# EAGLE design CMSIS-DAP.V1 (EAGLE 6.4)
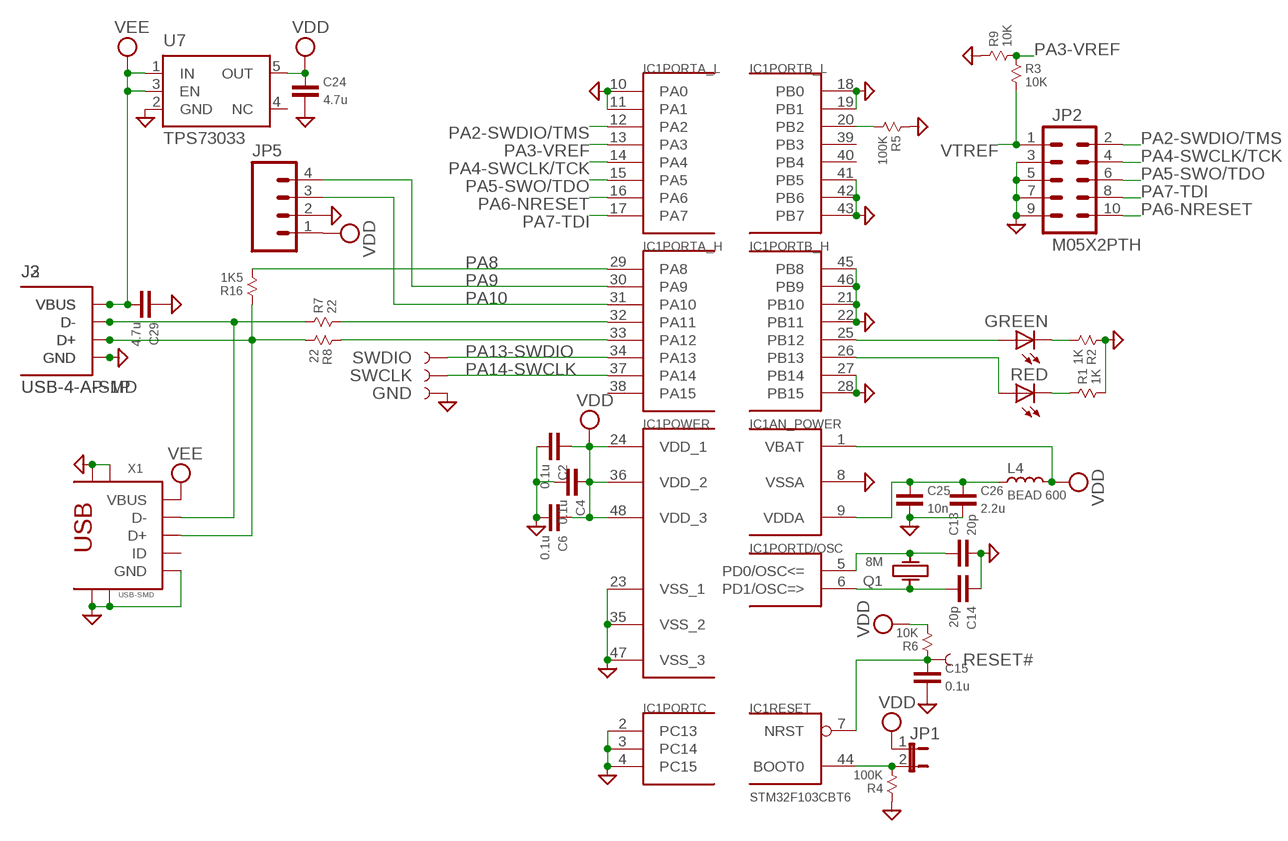
[diagram p0: schematic, sheet 1]

## Parts
C2  0.1u  CAP-0603  [0603]
C4  0.1u  CAP-0603  [0603]
C6  0.1u  CAP-0603  [0603]
C13  20p  CAP-0603  [0603]
C14  20p  CAP-0603  [0603]
C15  0.1u  CAP-0603  [0603]
C24  4.7u  CAP-0603  [0603]
C25  10n  CAP-0603  [0603]
C26  2.2u  CAP-0603  [0603]
C29  4.7u  CAP-0603  [0603]
GND  TEST-POINT1  [PAD.1X1]
GREEN  LEDCHIPLED_0603  [CHIPLED_0603]
IC1  STM32F103CBT6  STM32F10XCXT6  [TQFP48]
J2  USB-4-AP-1P  [USBAP-1P]
J3  USB-4-A-SMD  [USB-A-SMD]
JP1  JUMPER-2SMD-NO  [SJ_2S-NO]
JP2  M05X2PTH  [AVR_ICSP]
JP5  M04PTH  [1X04]
L4  BEAD 600  INDUCTOR-0603  [0603]
Q1  8M  CRYSTAL-KX-9A  [KX-9A]
R1  1K  RESISTOR-0603  [0603]
R2  1K  RESISTOR-0603  [0603]
R3  10K  RESISTOR-0603  [0603]
R4  100K  RESISTOR-0603  [0603]
R5  100K  RESISTOR-0603  [0603]
R6  10K  RESISTOR-0603  [0603]
R7  22  RESISTOR-0603  [0603]
R8  22  RESISTOR-0603  [0603]
R9  10K  RESISTOR-0603  [0603]
R16  1K5  RESISTOR-0603  [0603]
RED  LEDCHIPLED_0603  [CHIPLED_0603]
RESET#  TEST-POINT3  [PAD.03X.03]
SWCLK  TEST-POINT1  [PAD.1X1]
SWDIO  TEST-POINT1  [PAD.1X1]
U7  TPS73033  [SOT23-5]
X1  USB-SMD  [USB-MINIB]

## Nets
BOOT0: IC1.44(RESET:BOOT0) JP1.2 R4.2
GND: C2.1 C4.1 C6.1 C13.1 C14.2 C15.1 C24.1 C25.1 C26.1 C29.2 GND.P$1 IC1.2(PORTC:PC13) IC1.3(PORTC:PC14) IC1.4(PORTC:PC15) IC1.8(AN_POWER:VSSA) IC1.10(PORTA_L:PA0) IC1.11(PORTA_L:PA1) IC1.18(PORTB_L:PB0) IC1.19(PORTB_L:PB1) IC1.21(PORTB_H:PB10) IC1.22(PORTB_H:PB11) IC1.23(POWER:VSS_1) IC1.27(PORTB_H:PB14) IC1.28(PORTB_H:PB15) IC1.35(POWER:VSS_2) IC1.41(PORTB_L:PB5) IC1.42(PORTB_L:PB6) IC1.43(PORTB_L:PB7) IC1.45(PORTB_H:PB8) IC1.46(PORTB_H:PB9) IC1.47(POWER:VSS_3) J2.GND J3.GND JP2.3 JP2.5 JP2.7 JP2.9 JP5.2 R1.2 R2.1 R4.1 R5.1 R9.1 U7.2(GND) X1.GND X1.GND@1(GND) X1.GND@2(GND) X1.GND@3(GND) X1.GND@4(GND)
N$2: R1.1 RED.C
N$3: C25.2 C26.2 IC1.9(AN_POWER:VDDA) L4.1
N$10: J2.D- J3.D- R7.1 X1.D-
N$12: GREEN.C R2.2
N$13: J2.D+ J3.D+ R8.2 R16.1 X1.D+
OSCIN: C14.1 IC1.6(PORTD/OSC:PD1/OSC=>) Q1.1
OSCOUT: C13.2 IC1.5(PORTD/OSC:PD0/OSC<=) Q1.3
PA2-SWDIO/TMS: IC1.12(PORTA_L:PA2) JP2.2
PA3-VREF: IC1.13(PORTA_L:PA3) R3.1 R9.2
PA4-SWCLK/TCK: IC1.14(PORTA_L:PA4) JP2.4
PA5-SWO/TDO: IC1.15(PORTA_L:PA5) JP2.6
PA6-NRESET: IC1.16(PORTA_L:PA6) JP2.10
PA7-TDI: IC1.17(PORTA_L:PA7) JP2.8
PA8: IC1.29(PORTA_H:PA8) R16.2
PA9: IC1.30(PORTA_H:PA9) JP5.4
PA10: IC1.31(PORTA_H:PA10) JP5.3
PA11: IC1.32(PORTA_H:PA11) R7.2
PA12: IC1.33(PORTA_H:PA12) R8.1
PA13-SWDIO: IC1.34(PORTA_H:PA13) SWDIO.P$1
PA14-SWCLK: IC1.37(PORTA_H:PA14) SWCLK.P$1
PB2/BOOT1: IC1.20(PORTB_L:PB2) R5.2
PB12: GREEN.A IC1.25(PORTB_H:PB12)
PB13: IC1.26(PORTB_H:PB13) RED.A
RESET#: C15.2 IC1.7(RESET:NRST) R6.1 RESET#.P$1
VDD: C2.2 C4.2 C6.2 C24.2 IC1.1(AN_POWER:VBAT) IC1.24(POWER:VDD_1) IC1.36(POWER:VDD_2) IC1.48(POWER:VDD_3) JP1.1 JP5.1 L4.2 R6.2 U7.5(OUT)
VEE: C29.1 J2.VBUS J3.VUSB(VBUS) U7.1(IN) U7.3(EN) X1.VBUS
VTREF: JP2.1 R3.2
Unconnected: IC1.38(PORTA_H:PA15) IC1.39(PORTB_L:PB3) IC1.40(PORTB_L:PB4) U7.4(NC) X1.ID

## Library data of the parts
C2 C4 C6 C13-C15 C24-C26 C29 = X893:CAP: Capacitor
GND RESET# SWCLK SWDIO = SparkFun:TEST-POINT
GREEN RED = led:LED: LED OSRAM: - CHIPLED LG R971, LG N971, LY N971, LG Q971, LY Q971, LO R971, LY R971 LH N974, LH R974 LS Q976, LO Q976, LY Q976 LO Q996 - Hyper CHIPLED LW Q18S LB Q993, LB Q99A, LB R99A - SideLED LS A670, LO A670, LY A670, LG A670, LP A670 LB A673, LV A673, LT A673, LW A673 LH A674 LY A675 LS A676, LA A676, LO A676, LY A676, LW A676 LS A679, LY A679, LG A679 - Hyper Micro SIDELED® LS Y876, LA Y876, LO Y876, LY Y876 LT Y87S - SmartLED LW L88C, LW L88S LB L89C, LB L89S, LG L890 LS L89K, LO L89K, LY L89K LS L896, LA L896, LO L896, LY L896 - TOPLED LS T670, LO T670, LY T670, LG T670, LP T670 LSG T670, LSP T670, LSY T670, LOP T670, LYG T670 LG T671, LOG T671, LSG T671 LB T673, LV T673, LT T673, LW T673 LH T674 LS T676, LA T676, LO T676, LY T676, LB T676, LH T676, LSB T676, LW T676 LB T67C, LV T67C, LT T67C, LS T67K, LO T67K, LY T67K, LW E67C LS E67B, LA E67B, LO E67B, LY E67B, LB E67C, LV E67C, LT E67C LW T67C LS T679, LY T679, LG T679 LS T770, LO T770, LY T770, LG T770, LP T770 LB T773, LV T773, LT T773, LW T773 LH T774 LS E675, LA E675, LY E675, LS T675 LS T776, LA T776, LO T776, LY T776, LB T776 LHGB T686 LT T68C, LB T68C - Hyper Mini TOPLED® LB M676 - Mini TOPLED Santana® LG M470 LS M47K, LO M47K, LY M47K Source: http://www.osram.convergy.de LUXEON: - LUMILED® LXK2-PW12-R00, LXK2-PW12-S00, LXK2-PW14-U00, LXK2-PW14-V00 LXK2-PM12-R00, LXK2-PM12-S00, LXK2-PM14-U00 LXK2-PE12-Q00, LXK2-PE12-R00, LXK2-PE12-S00, LXK2-PE14-T00, LXK2-PE14-U00 LXK2-PB12-K00, LXK2-PB12-L00, LXK2-PB12-M00, LXK2-PB14-N00, LXK2-PB14-P00, LXK2-PB14-Q00 LXK2-PR12-L00, LXK2-PR12-M00, LXK2-PR14-Q00, LXK2-PR14-R00 LXK2-PD12-Q00, LXK2-PD12-R00, LXK2-PD12-S00 LXK2-PH12-R00, LXK2-PH12-S00 LXK2-PL12-P00, LXK2-PL12-Q00, LXK2-PL12-R00 Source: www.luxeon.com KINGBRIGHT: KA-3528ASYC Source: www.kingbright.com
IC1 = stm32:STM32F10XCXT6: ST STM32F101/103 48pin LQFP
J2 J3 = X893:USB-4: http://www.hirose.co.jp/cataloge_hp/e24200011.pdf
JP1 = SparkFun:JUMPER-2: Jumper Basic 0.1" spaced jumper. Use with breakaway headers.
JP2 = SparkFun:M05X2: Header 5x2 Standard 10-pin dual row 0.1" header. Commonly used with AVR-ISP. Use with Spark Fun Electronics SKU: PRT-00778
JP5 = SparkFun:M04: Header 4 Standard 4-pin 0.1" header. Use with straight break away headers (SKU : PRT-00116), right angle break away headers (PRT-00553), swiss pins (PRT-00743), machine pins (PRT-00117), and female headers (PRT-00115). Molex polarized connector foot print use with SKU : PRT-08231 with associated crimp pins and housings.
L4 = X893:INDUCTOR: http://www.murata.com/products/catalog/pdf/o05e.pdf
Q1 = X893:CRYSTAL: Crystal
R1-R9 R16 = X893:RESISTOR
U7 = X893:TPS73033: LOW-NOISE, HIGH PSRR, RF 200-mA LOW-DROPOUT LINEAR REGULATOR http://www.terraelectronica.ru/pdf/TI/TPS73033.pdf
X1 = X893:USB: USB Connectors USB-B-PTH is fully proven SKU : PRT-00139 USB-miniB is fully proven SKU : PRT-00587 USB-A-PCB is untested. USB-A-H is throughly reviewed, but untested. Spark Fun Electronics SKU : PRT-00437 USB-B-SMT is throughly reviewed, but untested. Needs silkscreen touching up. USB-A-S has not been used/tested USB-MB-H has not been used/tested

## Board
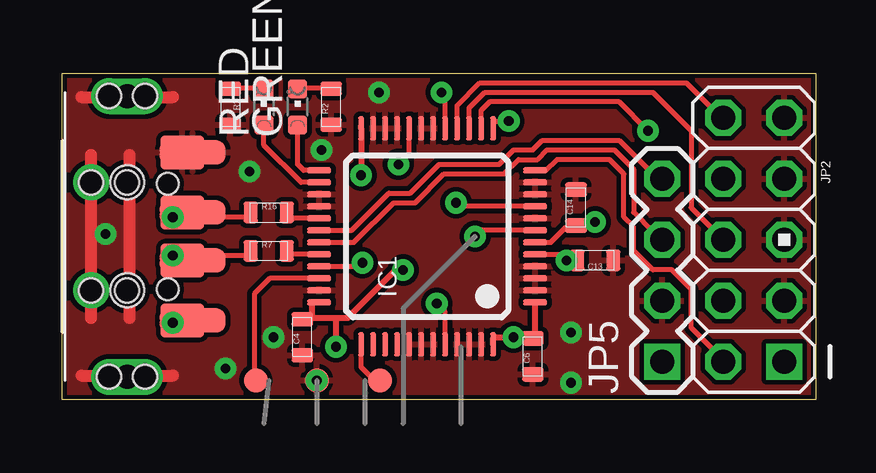
[diagram p1: board, top side]
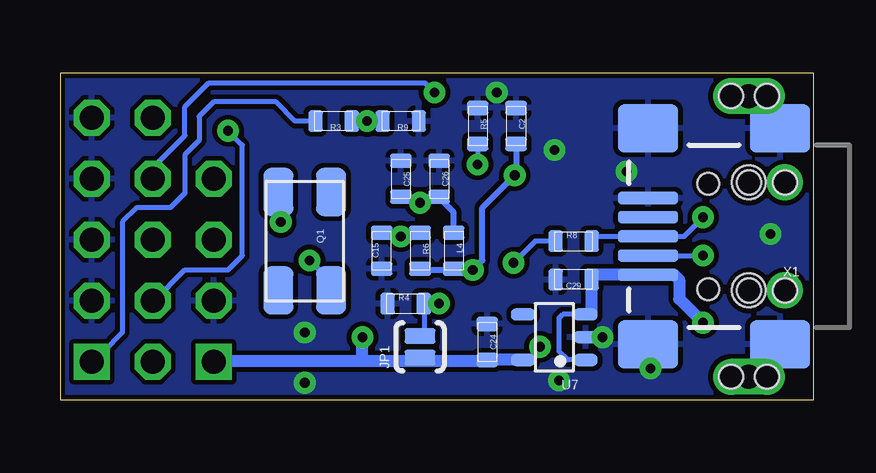
[diagram p2: board, bottom side, seen from below]

Size 31.4 x 13.6 mm. Coordinates in mm from the lower left corner, seen from the top.
Outline: 0,0 0,13.6 31.4,13.6 31.4,0 0,0
Copper layers (1*16): Top 0.035mm / dielectric 1.5mm / Bottom 0.035mm
Design rules "default": minimum track width 0.2mm, minimum drill 0.4mm, track to track 0.2mm, track to pad 0.2mm, pad to pad 0.2mm, via to via 0.2mm, smd to smd 0mil, copper to edge 0.2mm, drill to drill 0.2mm, minimum pad ring 0.25mm, minimum via ring 0.25mm, stop-mask expansion 4mil, vias tented up to drill 0.4mm, thermal gap 0.2mm

### Footprints (pad centres in the part's own frame; a part is rotated, then mirrored left to right if it is on the bottom)
0603 = smd 0.6 x 0.9: 1 -0.75,0; 2 0.75,0
PAD.1X1 = smd 1 x 1: P$1 0,0
CHIPLED_0603 = smd 0.8 x 0.8: A 0,-0.75; C 0,0.75
TQFP48 = smd 0.25 x 1: 1 -2.75,-4.5; 2 -2.25,-4.5; 3 -1.75,-4.5; 4 -1.25,-4.5; 5 -0.75,-4.5; 6 -0.25,-4.5; 7 0.25,-4.5; 8 0.75,-4.5; 9 1.25,-4.5; 10 1.75,-4.5; 11 2.25,-4.5; 12 2.75,-4.5; 25 2.75,4.5; 26 2.25,4.5; 27 1.75,4.5; 28 1.25,4.5; 29 0.75,4.5; 30 0.25,4.5; 31 -0.25,4.5; 32 -0.75,4.5; 33 -1.25,4.5; 34 -1.75,4.5; 35 -2.25,4.5; 36 -2.75,4.5 | smd 1 x 0.25: 13 4.5,-2.75; 14 4.5,-2.25; 15 4.5,-1.75; 16 4.5,-1.25; 17 4.5,-0.75; 18 4.5,-0.25; 19 4.5,0.25; 20 4.5,0.75; 21 4.5,1.25; 22 4.5,1.75; 23 4.5,2.25; 24 4.5,2.75; 37 -4.5,2.75; 38 -4.5,2.25; 39 -4.5,1.75; 40 -4.5,1.25; 41 -4.5,0.75; 42 -4.5,0.25; 43 -4.5,-0.25; 44 -4.5,-0.75; 45 -4.5,-1.25; 46 -4.5,-1.75; 47 -4.5,-2.25; 48 -4.5,-2.75
USBAP-1P = smd 1.4 x 1.8: D+ 1,-5; D- -1,-5; GND 3.5,-5; VBUS -3.5,-5 | drill 1: P$1 -2.25,-1.2; P$2 -2.25,-2.7; P$3 2.25,-1.2; P$4 2.25,-2.7 | hole 1: -2.25,-1.2; 2.25,-1.2; 2.25,-2.7; -2.25,-2.7
USB-A-SMD = smd 2.75 x 1: D+ 5.325,1; D- 5.325,-1; GND 5.325,3.5; VUSB 5.325,-3.5 | drill 1 pad 1.4 long: GND@1 2.6,5.85; GND@2 2.6,-5.85 | hole 1: 3.35,-5.85; 1.85,-5.85; 3.35,5.85; 1.85,5.85 | hole 1.4: 2.6,2.25; 2.6,-2.25
SJ_2S-NO = smd 0.635 x 1.27: 1 -0.45,0; 2 0.45,0
AVR_ICSP = drill 1 pad 1.5 square: 1 -1.27,5.08 | drill 1 pad 1.5 octagon: 2 1.27,5.08; 3 -1.27,2.54; 4 1.27,2.54; 5 -1.27,0; 6 1.27,0; 7 -1.27,-2.54; 8 1.27,-2.54; 9 -1.27,-5.08; 10 1.27,-5.08
1X04 = drill 1 pad 1.5 square: 1 0,0 | drill 1 pad 1.5 octagon: 2 2.54,0; 3 5.08,0; 4 7.62,0
KX-9A = smd 2 x 1.25: 1 -2.05,-1.1; 2 2.05,-1.1; 3 2.05,1.1; 4 -2.05,1.1
PAD.03X.03 = smd 0.762 x 0.762: P$1 0,0
SOT23-5 = smd 0.5 x 1: 1 -0.95,-1.3; 2 0,-1.3; 3 0.95,-1.3; 4 0.95,1.3; 5 -0.95,1.3
USB-MINIB = smd 2.5 x 0.5: D+ 2.5,0; D- 2.5,0.8; GND 2.5,-1.6; ID 2.5,-0.8; VBUS 2.5,1.6 | smd 2.5 x 2: GND@1 -3,-4.5; GND@2 -3,4.5; GND@3 2.5,4.5; GND@4 2.5,-4.5 | hole 0.9: 0,2.2; 0,-2.2

### Placement (x,y rotation side)
C2  12.4,11.4 270 bottom
C4  10,2.6 90 top
C6  19.6,1.8 90 top
C13  22.2,5.8 180 top
C14  21.4,8 90 top
C15  18,6.2 90 bottom
C24  13.6,2.4 270 bottom
C25  17.2,9.2 270 bottom
C26  15.6,9.2 270 bottom
C29  10,5 180 bottom
GND  10.6,0.8 0 top
GREEN  9.8,12.2 0 top
IC1  15.2,6.8 90 top
J2  0,6.8 90 top
J3  0.1,6.8 0 top
JP1  16.4,2.2 90 bottom
JP2  28.81,6.66 180 top
JP5  25,1.58 90 top
L4  15,6.2 270 bottom
Q1  21.2,6.6 270 bottom
R1  7,12.2 270 top
R2  11.2,12.2 90 top
R3  20,11.6 180 bottom
R4  17,4 0 bottom
R5  14,11.4 270 bottom
R6  16.4,6.2 270 bottom
R7  8.6,6.2 0 top
R8  10,6.6 0 bottom
R9  17.2,11.6 180 bottom
R16  8.6,7.8 0 top
RED  8.4,12.2 0 top
RESET#  17.2,6.8 270 bottom
SWCLK  13.24,0.8 0 top
SWDIO  8.06,0.8 0 top
U7  10.8,2.6 90 bottom
X1  4.4,6.8 180 bottom

### Tracks (layer width: path | path; a pad name or v marks a point on that pad's centre or on a via)
BOOT0  (via drill 0.4)
  Top 0.2: 15.8,3.8 v15.6,4 15.95,3.65 IC1.44
  Bottom 0.2: R4.2 16.2,4 | 16.2,4 v15.6,4 | JP1.2 16.2,2.65 16.2,4
GND  (via drill 0.4)
  Top 0.4: J2.GND J3.GND
  Top 0.5: 0.8,12.6 4.6,12.6 | 0.8,1 4.6,1 | 2.8,3.4 2.8,10.2 | 1.2,3.4 1.2,10.2
  other vias: 8.8,2.6 10.6,0.8 10.8,10.4 21.2,2.8 13.2,12.8 21.2,0.7 6.8,1.3 7.8,9.5 1.8,6.9
  pour Top: 0,13.6 0,0 31.4,0 31.4,13.6
  pour Bottom: 0,13.6 0,0 31.4,0 31.4,13.6
N$2
  Top 0.2: R1.1 7,13 8.4,13 RED.C
N$3  (via drill 0.4)
  Top 0.2: IC1.9 16.65,8.05 v16.4,8.2
  Bottom 0.2: C25.2 16.35,8.45 | 16.45,8.45 v16.4,8.2 16.35,8.45 | C26.2 16.35,8.45
  Bottom 0.25: L4.1 15,7.8 15.6,8.4 15.75,8.4 C26.2
N$10  (via drill 0.4)
  Top 0.2: J2.D- 4.8,5.8 v4.6,6 7.8,6 7.8,6.2 R7.1
  Top 0.4: J2.D- J3.D-
  Bottom 0.2: X1.D- v4.6,6
N$12
  Top 0.2: GREEN.C 9.8,13 11.15,13 R2.2
N$13  (via drill 0.4)
  Top 0.2: J2.D+ 4.8,7.8 v4.6,7.6 7.8,7.6 7.8,7.8 R16.1
  Top 0.4: J2.D+ J3.D+
  Bottom 0.2: v4.6,7.6 5.4,6.8 X1.D+ 9.2,6.8 9.2,6.6 R8.2
OSCIN  (via drill 0.4)
  Top 0.2: IC1.6 20.35,6.55 21,7.2 21.4,7.2 C14.1 21.4,7.4 v22.2,7.4
  Bottom 0.2: Q1.1 22.3,7.5 v22.2,7.4
OSCOUT  (via drill 0.4)
  Top 0.2: C13.2 v21,5.8 20.75,6.05 IC1.5
  Bottom 0.2: Q1.3 20.3,4.5 20.6,4.8 20.6,5.4 v21,5.8
PA2-SWDIO/TMS
  Top 0.2: JP2.2 27.4,1.72 27.4,1.8 26.2,3 26.2,4.6 25.4,5.4 24.6,5.4 23.8,6.2 23.8,7.2 23.4,7.6 23.4,9.4 22.8,10 20.6,10 20.15,9.55 IC1.12
PA3-VREF  (via drill 0.4)
  Top 0.2: IC1.13 R9.2 v18.6,11.6
  Bottom 0.2: R3.1 v18.6,11.6 R9.2
PA4-SWCLK/TCK  (via drill 0.4)
  Top 0.2: v24.4,11.2 23.2,12.4 17.8,12.4 17.45,12.05 IC1.14
  Bottom 0.2: JP2.4 27.48,4.12 26.2,5.4 24.4,5.4 23.8,6 23.8,10.6 v24.4,11.2
PA5-SWO/TDO
  Top 0.2: IC1.15 16.95,12.15 17.6,12.8 24.6,12.8 26.2,11.2 26.2,8 27.4,6.8 27.4,6.72 JP2.6
PA6-NRESET
  Top 0.2: IC1.16 16.45,12.25 17.4,13.2 26,13.2 27.2,12 27.28,12 JP2.10
PA7-TDI  (via drill 0.4)
  Top 0.2: IC1.17 15.95,12.65 v15.8,12.8
  Bottom 0.2: JP2.8 27.4,9.2 27.4,9.8 26.2,11 26.2,12.2 25.2,13.2 16.2,13.2 v15.8,12.8
PA8
  Top 0.2: IC1.29 9.45,7.55 9.4,7.6 R16.2
PA9
  Top 0.2: IC1.30 12.05,7.05 13.6,8.6 14.5,8.6 15.7,9.8 18.2,9.8 18.8,10.4 19.6,10.4 20,10.8 23.2,10.8 24.6,9.4 24.8,9.4 JP5.4
PA10
  Top 0.2: IC1.31 12.15,6.55 13.8,8.2 14.7,8.2 15.9,9.4 18.4,9.4 19,10 19.8,10 20.2,10.4 23,10.4 23.8,9.6 23.8,7.8 24.6,7 24.66,7 JP5.3
PA11
  Top 0.2: IC1.32 9.4,6.05 R7.2
PA12  (via drill 0.4)
  Top 0.2: v12.5,5.7 12.35,5.55 IC1.33
  Bottom 0.2: R8.1 11.6,6.6 v12.5,5.7
PA13-SWDIO
  Top 0.2: IC1.34 8.65,5.05 8,4.4 8,0.8 SWDIO.P$1
PA14-SWCLK
  Top 0.2: IC1.37 12.45,1.35 13,0.8 SWCLK.P$1
PB2/BOOT1  (via drill 0.4)
  Top 0.2: v14,9.8 14.45,10.25 IC1.20
  Bottom 0.2: R5.2 v14,9.8
PB12
  Top 0.2: IC1.25 10.05,9.55 9.8,9.8 GREEN.A
PB13
  Top 0.2: IC1.26 9.95,9.05 8.4,10.6 RED.A
RESET#  (via drill 0.4)
  Top 0.2: IC1.7 17.45,7.05 RESET#.P$1
  Bottom 0.2: R6.1 16.65,6.8 RESET#.P$1 17.45,6.95 C15.2
  other vias: 17.2,6.8
VDD  (via drill 0.4)
  Top 0.2: 19.55,2.6 C6.2
  Top 0.25: IC1.1 19.7,2.67 C6.2 | IC1.36 10.4,4.05 10.4,3.4 | 10.4,3.4 10,3.4 C4.2 | IC1.48 17.95,2.55 18,2.6 v18.8,2.6 19.55,2.6 | 10.4,3.4 11.4,3.4 | 11.4,3.4 v11.4,2.2 | 11.4,3.4 11.9,3.4 13.9,5.4 v14.2,5.4 | 12.45,11.4 IC1.24 v12.45,9.35
  Bottom 0.25: U7.5 11.75,1.65 11.4,2 v11.4,2.2 | R6.2 16.4,5.4 15,5.4 | 15,5.4 v14.2,5.4 13.8,5.8 13.8,8 v12.45,9.35 12.4,9.6 C2.2 | L4.2 15,5.4
  Bottom 0.5: U7.5 13.55,1.65 13.6,1.6 | C24.2 13.6,1.6 | 13.6,1.6 16.4,1.6 | 16.4,1.6 18.8,1.6 | 18.8,1.6 v18.8,2.6 | JP1.1 16.4,1.6 | 18.8,1.6 24.98,1.6 JP5.1
VEE  (via drill 0.4)
  Top 0.4: J2.VBUS J3.VUSB
  Top 0.5: J2.VBUS 4.7,3.3 v4.6,3.2
  Bottom 0.2: U7.1 10.25,1.65 10.6,2 10.6,3.4 10.45,3.55 U7.3
  Bottom 0.5: v4.6,3.2 5.6,4.2 5.6,5 5.8,5.2 X1.VBUS 9.05,5.2 C29.1 9.25,3.55 U7.3
VTREF
  Bottom 0.2: R3.2 21.6,11.6 22.4,12.4 25,12.4 25.6,11.8 25.6,10.8 26.2,10.2 26.2,8.6 26.8,8 28.2,8 28.8,7.4 28.8,2.8 29.6,2 29.66,2 JP2.1

### Text on the board
Reference: Version 1
tDocu: PA9-USART1_TX | PA10-USART1_RX | GND | LED | GREEN | +3.3V | RED | PA6-nRESET | GND | PA7-TDI | GND | PA5-SWO/TDO | GND | MiniUSB | PA4-SWCLK/TCK | GND | USB-A or | PA2-SWDIO/TMS | PA3-VTREF | PA13-SWDIO | GND | PA14-SWCLK | RESET | BOOT0